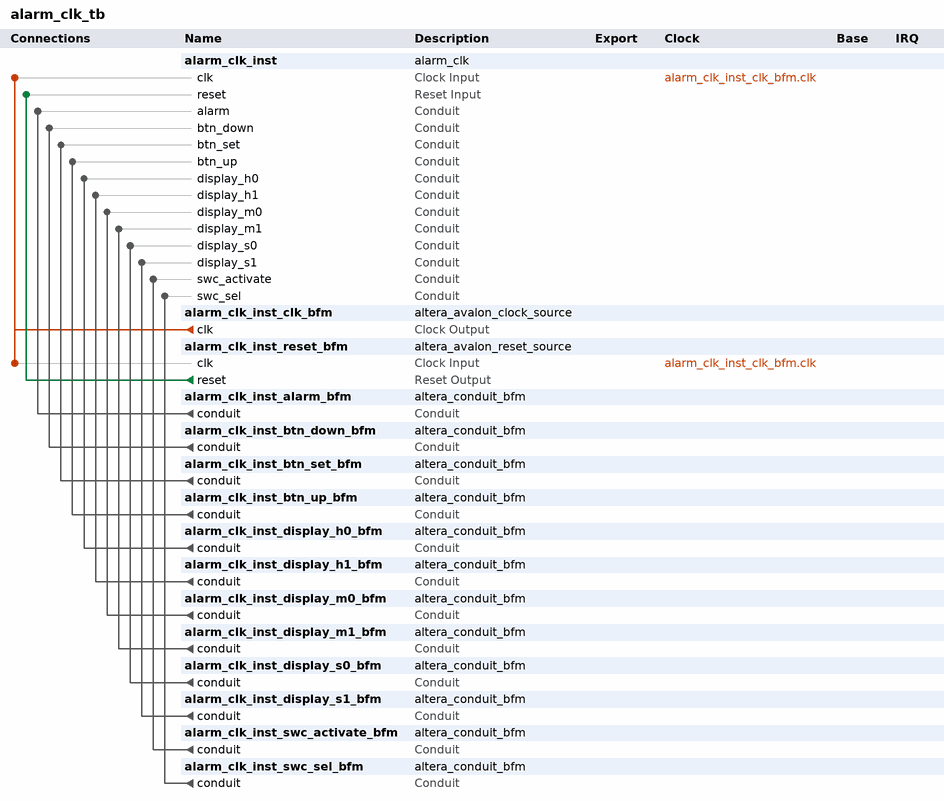
[diagram p0: system contents]
# Platform Designer (Qsys) system alarm_clk_tb, Cyclone V 5CEBA2F17A7
# Parameters at their usual value, and those the tool derives, are not listed.
package require -exact qsys 18.1
create_system alarm_clk_tb
set_project_property DEVICE_FAMILY {Cyclone V}
set_project_property DEVICE 5CEBA2F17A7

add_instance alarm_clk_inst alarm_clk 1.0

add_instance alarm_clk_inst_clk_bfm altera_avalon_clock_source 18.1

add_instance alarm_clk_inst_reset_bfm altera_avalon_reset_source 18.1
set_instance_parameter_value alarm_clk_inst_reset_bfm ASSERT_HIGH_RESET 0
set_instance_parameter_value alarm_clk_inst_reset_bfm INITIAL_RESET_CYCLES 50

add_instance alarm_clk_inst_alarm_bfm altera_conduit_bfm 18.1
set_instance_parameter_value alarm_clk_inst_alarm_bfm CLOCKED_SIGNAL false
set_instance_parameter_value alarm_clk_inst_alarm_bfm ENABLE_RESET false
set_instance_parameter_value alarm_clk_inst_alarm_bfm SIGNAL_DIRECTIONS input
set_instance_parameter_value alarm_clk_inst_alarm_bfm SIGNAL_WIDTHS 1

add_instance alarm_clk_inst_btn_down_bfm altera_conduit_bfm 18.1
set_instance_parameter_value alarm_clk_inst_btn_down_bfm CLOCKED_SIGNAL false
set_instance_parameter_value alarm_clk_inst_btn_down_bfm ENABLE_RESET false
set_instance_parameter_value alarm_clk_inst_btn_down_bfm SIGNAL_DIRECTIONS output
set_instance_parameter_value alarm_clk_inst_btn_down_bfm SIGNAL_WIDTHS 1

add_instance alarm_clk_inst_btn_set_bfm altera_conduit_bfm 18.1
set_instance_parameter_value alarm_clk_inst_btn_set_bfm CLOCKED_SIGNAL false
set_instance_parameter_value alarm_clk_inst_btn_set_bfm ENABLE_RESET false
set_instance_parameter_value alarm_clk_inst_btn_set_bfm SIGNAL_DIRECTIONS output
set_instance_parameter_value alarm_clk_inst_btn_set_bfm SIGNAL_WIDTHS 1

add_instance alarm_clk_inst_btn_up_bfm altera_conduit_bfm 18.1
set_instance_parameter_value alarm_clk_inst_btn_up_bfm CLOCKED_SIGNAL false
set_instance_parameter_value alarm_clk_inst_btn_up_bfm ENABLE_RESET false
set_instance_parameter_value alarm_clk_inst_btn_up_bfm SIGNAL_DIRECTIONS output
set_instance_parameter_value alarm_clk_inst_btn_up_bfm SIGNAL_WIDTHS 1

add_instance alarm_clk_inst_display_h0_bfm altera_conduit_bfm 18.1
set_instance_parameter_value alarm_clk_inst_display_h0_bfm CLOCKED_SIGNAL false
set_instance_parameter_value alarm_clk_inst_display_h0_bfm ENABLE_RESET false
set_instance_parameter_value alarm_clk_inst_display_h0_bfm SIGNAL_DIRECTIONS input
set_instance_parameter_value alarm_clk_inst_display_h0_bfm SIGNAL_WIDTHS 4

add_instance alarm_clk_inst_display_h1_bfm altera_conduit_bfm 18.1
set_instance_parameter_value alarm_clk_inst_display_h1_bfm CLOCKED_SIGNAL false
set_instance_parameter_value alarm_clk_inst_display_h1_bfm ENABLE_RESET false
set_instance_parameter_value alarm_clk_inst_display_h1_bfm SIGNAL_DIRECTIONS input
set_instance_parameter_value alarm_clk_inst_display_h1_bfm SIGNAL_WIDTHS 4

add_instance alarm_clk_inst_display_m0_bfm altera_conduit_bfm 18.1
set_instance_parameter_value alarm_clk_inst_display_m0_bfm CLOCKED_SIGNAL false
set_instance_parameter_value alarm_clk_inst_display_m0_bfm ENABLE_RESET false
set_instance_parameter_value alarm_clk_inst_display_m0_bfm SIGNAL_DIRECTIONS input
set_instance_parameter_value alarm_clk_inst_display_m0_bfm SIGNAL_WIDTHS 4

add_instance alarm_clk_inst_display_m1_bfm altera_conduit_bfm 18.1
set_instance_parameter_value alarm_clk_inst_display_m1_bfm CLOCKED_SIGNAL false
set_instance_parameter_value alarm_clk_inst_display_m1_bfm ENABLE_RESET false
set_instance_parameter_value alarm_clk_inst_display_m1_bfm SIGNAL_DIRECTIONS input
set_instance_parameter_value alarm_clk_inst_display_m1_bfm SIGNAL_WIDTHS 4

add_instance alarm_clk_inst_display_s0_bfm altera_conduit_bfm 18.1
set_instance_parameter_value alarm_clk_inst_display_s0_bfm CLOCKED_SIGNAL false
set_instance_parameter_value alarm_clk_inst_display_s0_bfm ENABLE_RESET false
set_instance_parameter_value alarm_clk_inst_display_s0_bfm SIGNAL_DIRECTIONS input
set_instance_parameter_value alarm_clk_inst_display_s0_bfm SIGNAL_WIDTHS 4

add_instance alarm_clk_inst_display_s1_bfm altera_conduit_bfm 18.1
set_instance_parameter_value alarm_clk_inst_display_s1_bfm CLOCKED_SIGNAL false
set_instance_parameter_value alarm_clk_inst_display_s1_bfm ENABLE_RESET false
set_instance_parameter_value alarm_clk_inst_display_s1_bfm SIGNAL_DIRECTIONS input
set_instance_parameter_value alarm_clk_inst_display_s1_bfm SIGNAL_WIDTHS 4

add_instance alarm_clk_inst_swc_activate_bfm altera_conduit_bfm 18.1
set_instance_parameter_value alarm_clk_inst_swc_activate_bfm CLOCKED_SIGNAL false
set_instance_parameter_value alarm_clk_inst_swc_activate_bfm ENABLE_RESET false
set_instance_parameter_value alarm_clk_inst_swc_activate_bfm SIGNAL_DIRECTIONS output
set_instance_parameter_value alarm_clk_inst_swc_activate_bfm SIGNAL_WIDTHS 1

add_instance alarm_clk_inst_swc_sel_bfm altera_conduit_bfm 18.1
set_instance_parameter_value alarm_clk_inst_swc_sel_bfm CLOCKED_SIGNAL false
set_instance_parameter_value alarm_clk_inst_swc_sel_bfm ENABLE_RESET false
set_instance_parameter_value alarm_clk_inst_swc_sel_bfm SIGNAL_DIRECTIONS output
set_instance_parameter_value alarm_clk_inst_swc_sel_bfm SIGNAL_WIDTHS 1

# connections
add_connection alarm_clk_inst_clk_bfm.clk alarm_clk_inst.clk clock
add_connection alarm_clk_inst_clk_bfm.clk alarm_clk_inst_reset_bfm.clk clock
add_connection alarm_clk_inst_reset_bfm.reset alarm_clk_inst.reset reset
add_connection alarm_clk_inst_alarm_bfm.conduit alarm_clk_inst.alarm conduit
add_connection alarm_clk_inst_btn_down_bfm.conduit alarm_clk_inst.btn_down conduit
add_connection alarm_clk_inst_btn_set_bfm.conduit alarm_clk_inst.btn_set conduit
add_connection alarm_clk_inst_btn_up_bfm.conduit alarm_clk_inst.btn_up conduit
add_connection alarm_clk_inst_display_h0_bfm.conduit alarm_clk_inst.display_h0 conduit
add_connection alarm_clk_inst_display_h1_bfm.conduit alarm_clk_inst.display_h1 conduit
add_connection alarm_clk_inst_display_m0_bfm.conduit alarm_clk_inst.display_m0 conduit
add_connection alarm_clk_inst_display_m1_bfm.conduit alarm_clk_inst.display_m1 conduit
add_connection alarm_clk_inst_display_s0_bfm.conduit alarm_clk_inst.display_s0 conduit
add_connection alarm_clk_inst_display_s1_bfm.conduit alarm_clk_inst.display_s1 conduit
add_connection alarm_clk_inst_swc_activate_bfm.conduit alarm_clk_inst.swc_activate conduit
add_connection alarm_clk_inst_swc_sel_bfm.conduit alarm_clk_inst.swc_sel conduit

set_interconnect_requirement {$system} qsys_mm.clockCrossingAdapter HANDSHAKE
set_interconnect_requirement {$system} qsys_mm.enableEccProtection FALSE
set_interconnect_requirement {$system} qsys_mm.insertDefaultSlave FALSE
set_interconnect_requirement {$system} qsys_mm.maxAdditionalLatency 1

save_system alarm_clk_tb.qsys
